# Altium schematic sheet Axis.SchDoc
size A4; SheetNumber: 3; SheetTotal: 8
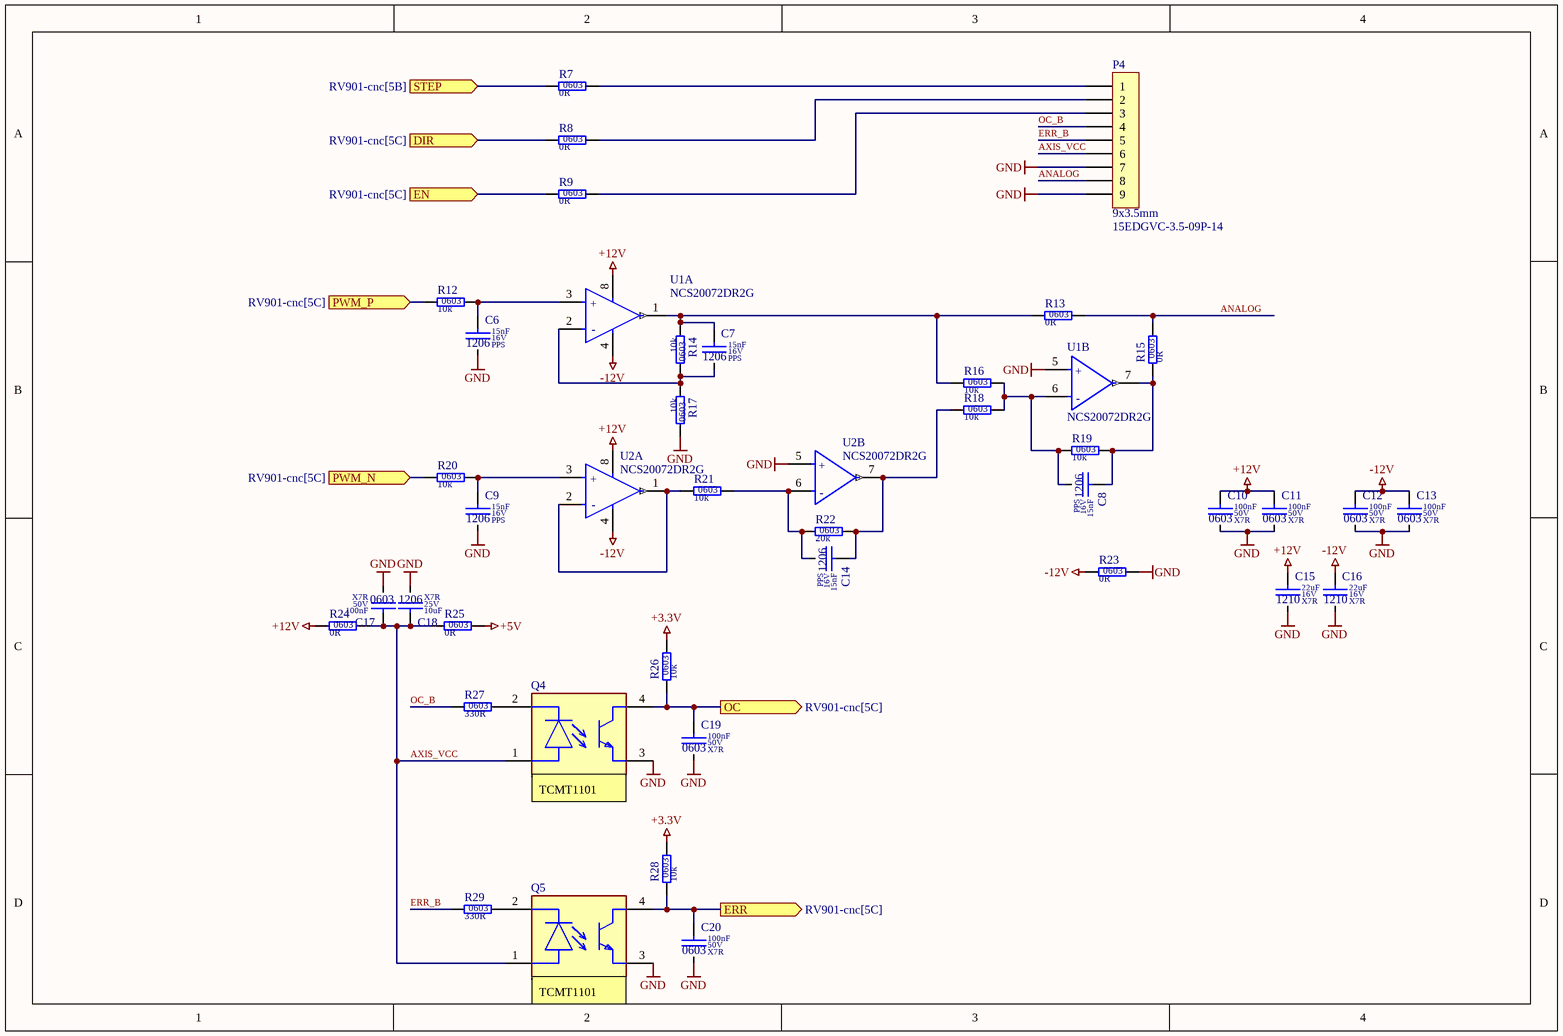
[diagram p0: Axis.SchDoc]

## Parts
C6  value 15nF  Dielectric: PPS  Voltage: 16V  SCH_Footprint: 1206  [C_1206_3216]  (hidden comment: Film Capacitor)
C7  value 15nF  Dielectric: PPS  Voltage: 16V  SCH_Footprint: 1206  [C_1206_3216]  (hidden comment: Film Capacitor)
C8  value 15nF  Dielectric: PPS  Voltage: 16V  SCH_Footprint: 1206  [C_1206_3216]  (hidden comment: Film Capacitor)
C9  value 15nF  Dielectric: PPS  Voltage: 16V  SCH_Footprint: 1206  [C_1206_3216]  (hidden comment: Film Capacitor)
C10  value 100nF  Dielectric: X7R  Voltage: 50V  SCH_Footprint: 0603  [C_0603_1608]  (hidden comment: Ceramic X7R)
C11  value 100nF  Dielectric: X7R  Voltage: 50V  SCH_Footprint: 0603  [C_0603_1608]  (hidden comment: Ceramic X7R)
C12  value 100nF  Dielectric: X7R  Voltage: 50V  SCH_Footprint: 0603  [C_0603_1608]  (hidden comment: Ceramic X7R)
C13  value 100nF  Dielectric: X7R  Voltage: 50V  SCH_Footprint: 0603  [C_0603_1608]  (hidden comment: Ceramic X7R)
C14  value 15nF  Dielectric: PPS  Voltage: 16V  SCH_Footprint: 1206  [C_1206_3216]  (hidden comment: Film Capacitor)
C15  value 22uF  Dielectric: X7R  Voltage: 16V  SCH_Footprint: 1210  [C_1210_3225]  (hidden comment: Ceramic X7R)
C16  value 22uF  Dielectric: X7R  Voltage: 16V  SCH_Footprint: 1210  [C_1210_3225]  (hidden comment: Ceramic X7R)
C17  value 100nF  Dielectric: X7R  Voltage: 50V  SCH_Footprint: 0603  [C_0603_1608]  (hidden comment: Ceramic X7R)
C18  value 10uF  Dielectric: X7R  Voltage: 25V  SCH_Footprint: 1206  [C_1206_3216]  (hidden comment: Ceramic X7R)
C19  value 100nF  Dielectric: X7R  Voltage: 50V  SCH_Footprint: 0603  [C_0603_1608]  (hidden comment: Ceramic X7R)
C20  value 100nF  Dielectric: X7R  Voltage: 50V  SCH_Footprint: 0603  [C_0603_1608]  (hidden comment: Ceramic X7R)
P4  value 15EDGVC-3.5-09P-14  SCH_Footprint: 9x3.5mm  [P_15EDGVC-3.5-09P]  (hidden comment: 9-pin 3.5mm terminal block)
Q4  TCMT1106  [FP-TCMT1106-MFG]
Q5  TCMT1106  [FP-TCMT1106-MFG]
R7  value 0R  SCH_Footprint: 0603  [R_0603_1608]  (hidden comment: Resistor)
R8  value 0R  SCH_Footprint: 0603  [R_0603_1608]  (hidden comment: Resistor)
R9  value 0R  SCH_Footprint: 0603  [R_0603_1608]  (hidden comment: Resistor)
R12  value 10k  SCH_Footprint: 0603  [R_0603_1608]  (hidden comment: Resistor)
R13  value 0R  SCH_Footprint: 0603  [R_0603_1608]  (hidden comment: Resistor)
R14  value 10k  SCH_Footprint: 0603  [R_0603_1608]  (hidden comment: Resistor)
R15  value 0R  SCH_Footprint: 0603  [R_0603_1608]  (hidden comment: Resistor)
R16  value 10k  SCH_Footprint: 0603  [R_0603_1608]  (hidden comment: Resistor)
R17  value 10k  SCH_Footprint: 0603  [R_0603_1608]  (hidden comment: Resistor)
R18  value 10k  SCH_Footprint: 0603  [R_0603_1608]  (hidden comment: Resistor)
R19  value 10k  SCH_Footprint: 0603  [R_0603_1608]  (hidden comment: Resistor)
R20  value 10k  SCH_Footprint: 0603  [R_0603_1608]  (hidden comment: Resistor)
R21  value 10k  SCH_Footprint: 0603  [R_0603_1608]  (hidden comment: Resistor)
R22  value 20k  SCH_Footprint: 0603  [R_0603_1608]  (hidden comment: Resistor)
R23  value 0R  SCH_Footprint: 0603  [R_0603_1608]  (hidden comment: Resistor)
R24  value 0R  SCH_Footprint: 0603  [R_0603_1608]  (hidden comment: Resistor)
R25  value 0R  SCH_Footprint: 0603  [R_0603_1608]  (hidden comment: Resistor)
R26  value 10k  SCH_Footprint: 0603  [R_0603_1608]  (hidden comment: Resistor)
R27  value 330R  SCH_Footprint: 0603  [R_0603_1608]  (hidden comment: Resistor)
R28  value 10k  SCH_Footprint: 0603  [R_0603_1608]  (hidden comment: Resistor)
R29  value 330R  SCH_Footprint: 0603  [R_0603_1608]  (hidden comment: Resistor)
U1  NCS20072DR2G  [FP-751-07-MFG]  (parts A,B of 2)
U2  NCS20072DR2G  [FP-751-07-MFG]  (parts A,B of 2)

## Ports
DIR (in, see RV901-cnc[5C]), EN (in, see RV901-cnc[5C]), ERR (out, see RV901-cnc[5C]), OC (out, see RV901-cnc[5C]), PWM_N (in, see RV901-cnc[5C]), PWM_P (in, see RV901-cnc[5C]), STEP (in, see RV901-cnc[5B])

## Nets
+3.3V: R26.2 R28.2
+5V: R25.2
+12V: C10.1 C11.1 C15.1 R24.1 U1.8(VDD) U2.8(VDD)
-12V: C12.1 C13.1 C16.1 R23.1 U1.4(VSS) U2.4(VSS)
GND: C6.2 C9.2 C10.2 C11.2 C12.2 C13.2 C15.2 C16.2 C17.2 C18.2 C19.2 C20.2 P4.7 P4.9 Q4.3(E) Q5.3(E) R17.2 R23.2 U1.5(IN+_2) U2.5(IN+_2)
ANALOG: P4.8 R13.2 R15.2
AXIS_VCC: C17.1 C18.1 P4.6 Q4.1(A) Q5.1(A) R24.2 R25.1
DIR: R8.1 ; port DIR
EN: R9.1 ; port EN
ERR: C20.1 Q5.4(C) R28.1 ; port ERR
ERR_B: P4.5 R29.1
OC: C19.1 Q4.4(C) R26.1 ; port OC
OC_B: P4.4 R27.1
PWM_N: R20.1 ; port PWM_N
PWM_P: R12.1 ; port PWM_P
STEP: R7.1 ; port STEP
NetC6_1: C6.1 R12.2 U1.3(IN+_1)
NetC7_1: C7.1 R13.1 R14.1 R16.1 U1.1(OUT_1)
NetC7_2: C7.2 R14.2 R17.1 U1.2(IN-_1)
NetC8_1: C8.1 R15.1 R19.2 U1.7(OUT_2)
NetC8_2: C8.2 R16.2 R18.2 R19.1 U1.6(IN-_2)
NetC9_1: C9.1 R20.2 U2.3(IN+_1)
NetC14_1: C14.1 R18.1 R22.2 U2.7(OUT_2)
NetC14_2: C14.2 R21.2 R22.1 U2.6(IN-_2)
NetP4_1: P4.1 R7.2
NetP4_2: P4.2 R8.2
NetP4_3: P4.3 R9.2
NetQ4_2: Q4.2(C) R27.2
NetQ5_2: Q5.2(C) R29.2
NetR21_1: R21.1 U2.1(OUT_1) U2.2(IN-_1)

## Notes on the sheet
- (near Q4) TCMT1101
- (near Q5) TCMT1101
- (in symbol CMP-07106-000003-1, part A) +; -
- (in symbol CMP-07106-000003-1, part B) +; -

## Library data of the parts
C6-C9 C14 = C_15nF_16V_PPS_1206_2: Capacitor; Manufacturer: Panasonic; Manufacturer Part Number: ECH-U1C153GX5; Tolerance (%): 2; Part Number: C_15nF_16V_PPS_1206_2; HelpURL: https://mediap.industry.panasonic.eu/assets/imported/industrial.panasonic.com/cdbs/www-data/pdf/RDI0000/ABD0000C173.pdf; Supplier 1: TME; Supplier Part Number 1: ECHU1C153GX5; Supplier 2: RS Components; Supplier Part Number 2: 414-7018; Supplier 3: Farnell; Supplier Part Number 3: 9694900; Supplier 4: Mouser; Supplier Part Number 4: 667-ECH-U1C153GX5; Supplier 5: Digi-Key; Supplier Part Number 5: PCF1179CT-ND; Supplier 6: LCSC
C10-C13 C17 C19 C20 = C_100nF_50V_X7R_0603_5: Capacitor; Manufacturer: Samsung; Manufacturer Part Number: CL10B104JB8NNNC; Tolerance (%): 5; Part Number: C_100nF_50V_X7R_0603_5; HelpURL: http://www.tme.eu/pl/Document/4a42202b32dab16128fe107dd69598cc/samsung-chip-cap.pdf; Supplier 1: TME; Supplier Part Number 1: CL10B104JB8NNNC; Supplier 2: RS Components; Supplier Part Number 2: 7665455; Supplier 3: Farnell; Supplier 4: Mouser; Supplier 5: Digi-Key; Supplier Part Number 5: 1276-1033-1-ND; Supplier 6: LCSC; Supplier Part Number 6: C24452
C15 C16 = C_22uF_16V_X7R_1210_10_AECQ1: Capacitor; Manufacturer: Murata; Manufacturer Part Number: GCM32ER71C226KE19L; Tolerance (%): 10; AEC-Q: 1; Part Number: C_22uF_16V_X7R_1210_10_AECQ1; HelpURL: https://www.murata.com/products/productdetail?partno=GCM32ER71C226KE19%23; Supplier 1: TME; Supplier Part Number 1: GCM32ER71C226KE19L; Supplier 2: RS Components; Supplier 3: Farnell; Supplier Part Number 3: 3790409; Supplier 4: Mouser; Supplier Part Number 4: 81-GCM32ER71C226K19L; Supplier 5: Digi-Key; Supplier Part Number 5: 490-5242-1-ND; Supplier 6: LCSC; Supplier Part Number 6: C126614
C18 = C_10uF_25V_X7R_1206_10: Capacitor; Manufacturer: Samsung; Manufacturer Part Number: CL31B106KAHNNNE; Tolerance (%): 10; Part Number: C_10uF_25V_X7R_1206_10; HelpURL: http://www.tme.eu/pl/Document/4a42202b32dab16128fe107dd69598cc/samsung-chip-cap.pdf; Supplier 1: TME; Supplier Part Number 1: CL31B106KAHNNNE; Supplier 2: RS Components; Supplier Part Number 2: 766-6773; Supplier 3: Farnell; Supplier Part Number 3: 3013526; Supplier 4: Mouser; Supplier Part Number 4: 187-CL31B106KAHNNNE; Supplier 5: Digi-Key; Supplier Part Number 5: 1276-1804-1-ND; Supplier 6: LCSC
P4 = P_15EDGVC-3.5-09P-14: Pin Header; Manufacturer: DEGSON ELECTRONICS; Part Number: P_15EDGVC-3.5-09P-14; HelpURL: https://www.tme.eu/Document/83e7173fe653a2d0e44585e87978945b/opr014R8.pdf; Manufacturer Part Number: 15EDGVC-3.5-09P-14; Supplier 1: TME; Supplier 2: RS Components; Supplier 3: Farnell; Supplier 4: Mouser; Supplier 5: Digi-Key; Supplier 6: LCSC; Supplier Part Number 6: C5188325; Supplier 7: Micros; Supplier Part Number 7: Z TLPHC001v-09p
Q4 Q5 = CMP-00030-39642376-1: TCMT1106 TCMT1106 Vishay Transistor Output Optocouplers Phototransistor Out 3750Vrms1 Channel 4-SOP RoHS; Current Transfer Ratio: 300%; Reverse Voltage: 6V; Number of Channels: 1; Turn-Off Delay Time: 8.5µs; Power Dissipation: 250mW; Output Current per Channel: 50mA; Voltage Rating (DC): 70V; Forward Current: 60mA; Turn-On Delay Time: 9.5µs; Rise Time: 3s; Isolation Voltage: 3.75kV; Fall Time: 4.7s; Max Junction Temperature (Tj): 125°C; Collector Emitter Saturation Voltage: 300mV; Forward Voltage: 1.35V; Ambient Temperature Range High: 100°C; Height: 2.3mm; Mount: PCB, Surface Mount; Max Operating Temperature: 100°C; Radiation Hardening: No; RoHS: Compliant; Min Operating Temperature: -40°C; NexarPartId: 39642376; Number of Pins: 4; Output Voltage: 70V; Max Output Voltage: 70V; Reverse Breakdown Voltage: 6V; Voltage: 6V; Collector Emitter Voltage (VCEO): 70V; Number of Elements: 1; Max Collector Current: 50mA; Schedule B: 8541408000, 8541408000; Input Current: 50mA; Max Power Dissipation: 250mW; Packaging: Tape and Reel; Max Input Current: 60mA; Case/Package: SOP; Lead Free: Lead Free; REACH SVHC: Unknown
R7-R9 R13 R15 R23-R25 = R_0R_0603_1: Manufacturer: Yageo; Manufacturer Part Number: RC0603FR-070RL; Voltage: 75V; Power: 100mW; Tolerance: 1%; Part Number: R_0R_0603_1; HelpURL: https://datasheet.octopart.com/RC0603FR-070RL-Yageo-datasheet-8328172.pdf; Supplier 1: TME; Supplier Part Number 1: RC0603FR-070RL; Supplier 2: RS Components; Supplier 3: Farnell; Supplier Part Number 3: 2309106; Supplier 4: Mouser; Supplier Part Number 4: 603-RC0603FR-070RL; Supplier 5: Digi-Key; Supplier Part Number 5: 311-0.0HRCT-ND; Supplier 6: LCSC; Supplier Part Number 6: C100044
R12 R14 R16-R21 R26 R28 = R_10k_0603_1_AECQ0: Manufacturer: Panasonic; Manufacturer Part Number: ERJ-3EKF1002V; Voltage: 75V; Power: 100mW; Tolerance: 1%; AEC-Q: 0; Part Number: R_10k_0603_1_AECQ0; HelpURL: https://industrial.panasonic.com/cdbs/www-data/pdf/RDA0000/AOA0000C304.pdf; Supplier 1: TME; Supplier Part Number 1: ERJ3EKF1002V; Supplier 2: RS Components; Supplier 3: Farnell; Supplier Part Number 3: 2303192; Supplier 4: Mouser; Supplier Part Number 4: 667-ERJ-3EKF1002V; Supplier 5: Digi-Key; Supplier Part Number 5: P10.0KHCT-ND; Supplier 6: LCSC; Supplier Part Number 6: C191124
R22 = R_20k_0603_1_AECQ0: Manufacturer: Panasonic; Manufacturer Part Number: ERJ-3EKF2002V; Voltage: 75V; Power: 100mW; Tolerance: 1%; AEC-Q: 0; Part Number: R_20k_0603_1_AECQ0; HelpURL: https://industrial.panasonic.com/cdbs/www-data/pdf/RDA0000/AOA0000C304.pdf; Supplier 1: TME; Supplier Part Number 1: ERJ3EKF2002V; Supplier 2: RS Components; Supplier 3: Farnell; Supplier Part Number 3: 2059432; Supplier 4: Mouser; Supplier Part Number 4: 667-ERJ-3EKF2002V; Supplier 5: Digi-Key; Supplier Part Number 5: P20.0KHCT-ND; Supplier 6: LCSC; Supplier Part Number 6: C403057
R27 R29 = R_330R_0603_1: Manufacturer: Yageo; Manufacturer Part Number: RC0603FR-07330RL; Voltage: 50V; Power: 100mW; Tolerance: 1%; Part Number: R_330R_0603_1; HelpURL: http://datasheet.octopart.com/RC0603FR-07330RL-Yageo-datasheet-8328172.pdf; Supplier 1: TME; Supplier Part Number 1: RC0603FR-07330R; Supplier 2: RS Components; Supplier Part Number 2: 5046499; Supplier 3: Farnell; Supplier Part Number 3: 9238425; Supplier 4: Mouser; Supplier Part Number 4: 603-RC0603FR-07330RL; Supplier 5: Digi-Key; Supplier Part Number 5: 311-330HRCT-ND; Supplier 6: LCSC
U1 U2 = CMP-07106-000003-1: IC OPAMP 3MHZ RRO DUAL 8SOIC; Manufacturer: ON Semiconductor; Standoff Height: 0.1mm; Voltage Gain: 118-120dB; Max Junction Temp: +150°C; Min Supply Voltage: 2.7V; Max Dual Supply Voltage: 18V; Output Current Per Channel: 465uA; Input Bias Current: 0.000005uA; Input Offset Voltage: 1.3mV; Min Dual Supply Voltage: 1.35V; Max Supply Voltage: 36V; Nominal Supply Current: 405-465uA; Number Of Channels: 2; Gain Bandwidth: 3MHz; Temperature: -40°C to +125°C; Temperature Range High: +125°C; Ambient Temperature Range Low: -40°C; Device Class L1: Integrated Circuits (ICs); ComponentLink2Description: Datasheet; Package: 751-07; Lead Free: Yes; ComponentLink2URL: http://www.onsemi.com/pub/Collateral/NCS20071-D.PDF; Mouser Description: Operational Amplifiers - Op Amps R2R DUAL AMPLIFIER; Manufacturer Part Number: NCS20072DR2G; Octopart: https://octopart.com/ncs20072dr2g-on+semiconductor-56676507; Automotive: No; Device Class L3: Amplifiers - Op Amps; Device Class L2: Linear ICs; Category: IC; Bandwidth: 3MHz; Footprint Url: http://www.onsemi.com/pub/Collateral/751-07.PDF; RoHS: TRUE; Temperature Range Low: -40°C; Ambient Temperature Range High: +125°C; Height: 1.75mm; Digikey Description: IC OPAMP 3MHZ RRO DUAL 8SOIC